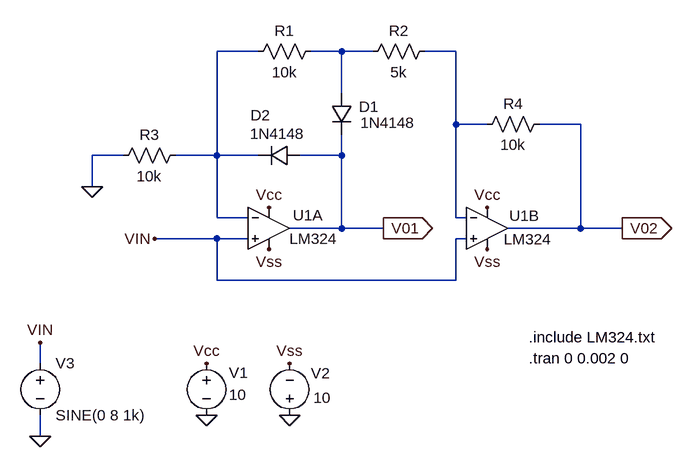
[diagram p0: schematic lab1-3.asc]
lab1-3.asc, the LTspice schematic file:
Version 4.1
SHEET 1 884 680
WIRE -16 -16 -80 -16
WIRE 112 -16 64 -16
WIRE 160 -16 112 -16
WIRE 288 -16 240 -16
WIRE 112 48 112 -16
WIRE 288 96 288 -16
WIRE 336 96 288 96
WIRE 480 96 416 96
WIRE -224 144 -272 144
WIRE -80 144 -80 -16
WIRE -80 144 -144 144
WIRE -16 144 -80 144
WIRE 112 144 112 112
WIRE 112 144 48 144
WIRE -272 192 -272 144
WIRE -80 240 -80 144
WIRE -32 240 -80 240
WIRE 288 240 288 96
WIRE 304 240 288 240
WIRE 112 256 112 144
WIRE 112 256 32 256
WIRE 176 256 112 256
WIRE 480 256 480 96
WIRE 480 256 368 256
WIRE 544 256 480 256
WIRE -80 272 -176 272
WIRE -32 272 -80 272
WIRE 304 272 288 272
WIRE -80 336 -80 272
WIRE 288 336 288 272
WIRE 288 336 -80 336
WIRE -352 464 -352 432
WIRE -352 576 -352 544
FLAG -272 192 0
FLAG -96 544 0
FLAG 32 544 0
FLAG -96 464 Vcc
FLAG 32 464 Vss
FLAG 336 288 Vss
FLAG 0 288 Vss
FLAG 0 224 Vcc
FLAG 336 224 Vcc
FLAG -352 576 0
FLAG 544 256 V02
IOPIN 544 256 Out
FLAG 176 256 V01
IOPIN 176 256 Out
FLAG -352 432 VIN
FLAG -176 272 VIN
SYMBOL OpAmps\\opamp2 0 192 R0
WINDOW 0 37 44 Left 2
WINDOW 3 32 80 Left 2
SYMATTR InstName U1A
SYMATTR Value LM324
SYMBOL OpAmps\\opamp2 336 192 R0
WINDOW 0 34 45 Left 2
WINDOW 3 26 81 Left 2
SYMATTR InstName U1B
SYMATTR Value LM324
SYMBOL res 80 -32 R90
WINDOW 0 0 56 VBottom 2
WINDOW 3 32 56 VTop 2
SYMATTR InstName R1
SYMATTR Value 10k
SYMATTR SpiceLine tol=1
SYMBOL res 256 -32 R90
WINDOW 0 0 56 VBottom 2
WINDOW 3 32 56 VTop 2
SYMATTR InstName R2
SYMATTR Value 5k
SYMATTR SpiceLine tol=1
SYMBOL res -128 128 R90
WINDOW 0 0 56 VBottom 2
WINDOW 3 32 56 VTop 2
SYMATTR InstName R3
SYMATTR Value 10k
SYMATTR SpiceLine tol=1
SYMBOL res 432 80 R90
WINDOW 0 0 56 VBottom 2
WINDOW 3 32 56 VTop 2
SYMATTR InstName R4
SYMATTR Value 10k
SYMATTR SpiceLine tol=1
SYMBOL diode 96 48 R0
WINDOW 3 45 46 Left 2
WINDOW 0 43 21 Left 2
SYMATTR Value 1N4148
SYMATTR InstName D1
SYMBOL diode 48 128 R90
WINDOW 0 -30 61 VBottom 2
WINDOW 3 -33 35 VTop 2
SYMATTR InstName D2
SYMATTR Value 1N4148
SYMBOL voltage -96 448 R0
WINDOW 0 35 30 Left 2
WINDOW 3 35 64 Left 2
WINDOW 123 0 0 Left 0
WINDOW 39 0 0 Left 0
SYMATTR InstName V1
SYMATTR Value 10
SYMBOL voltage 32 560 R180
WINDOW 0 -62 81 Left 2
WINDOW 3 -64 43 Left 2
WINDOW 123 0 0 Left 0
WINDOW 39 0 0 Left 0
SYMATTR InstName V2
SYMATTR Value 10
SYMBOL voltage -352 448 R0
WINDOW 123 0 0 Left 0
WINDOW 39 0 0 Left 0
SYMATTR InstName V3
SYMATTR Value SINE(0 8 1k)
TEXT 400 456 Left 2 !.tran 0 0.002 0
TEXT 400 424 Left 2 !.include LM324.txt

The netlist it stands for:
* lab1-3.asc
X§U1A VIN N001 Vcc Vss V01 LM324  ; pins In+ In- V+ V- OUT
X§U1B VIN N003 Vcc Vss V02 LM324  ; pins In+ In- V+ V- OUT
R1 N002 N001 10k tol=1
R2 N003 N002 5k tol=1
R3 N001 0 10k tol=1
R4 V02 N003 10k tol=1
D1 N002 V01 1N4148
D2 V01 N001 1N4148
V1 Vcc 0 10
V2 0 Vss 10
V3 VIN 0 SINE(0 8 1k)
.model D D
.lib standard.dio
.tran 0 0.002 0
.include LM324.txt
.backanno
.end